# EasyEDA Pro project v10_b.eprj

# Schematic Schematic1
Board Name: Board1; Create Date: 2025-07-11; Page Name: P1; Project Name: v9_d_w_USB; Schematic Name: Schematic1; Update Date: 2025-12-03; Company: KC3LBR; Drawed: EasyEDA Pro; Page Size: A3; Part Number: JLCPCB-001; Reviewed: EasyEDA Pro; Version: 2023.09.11
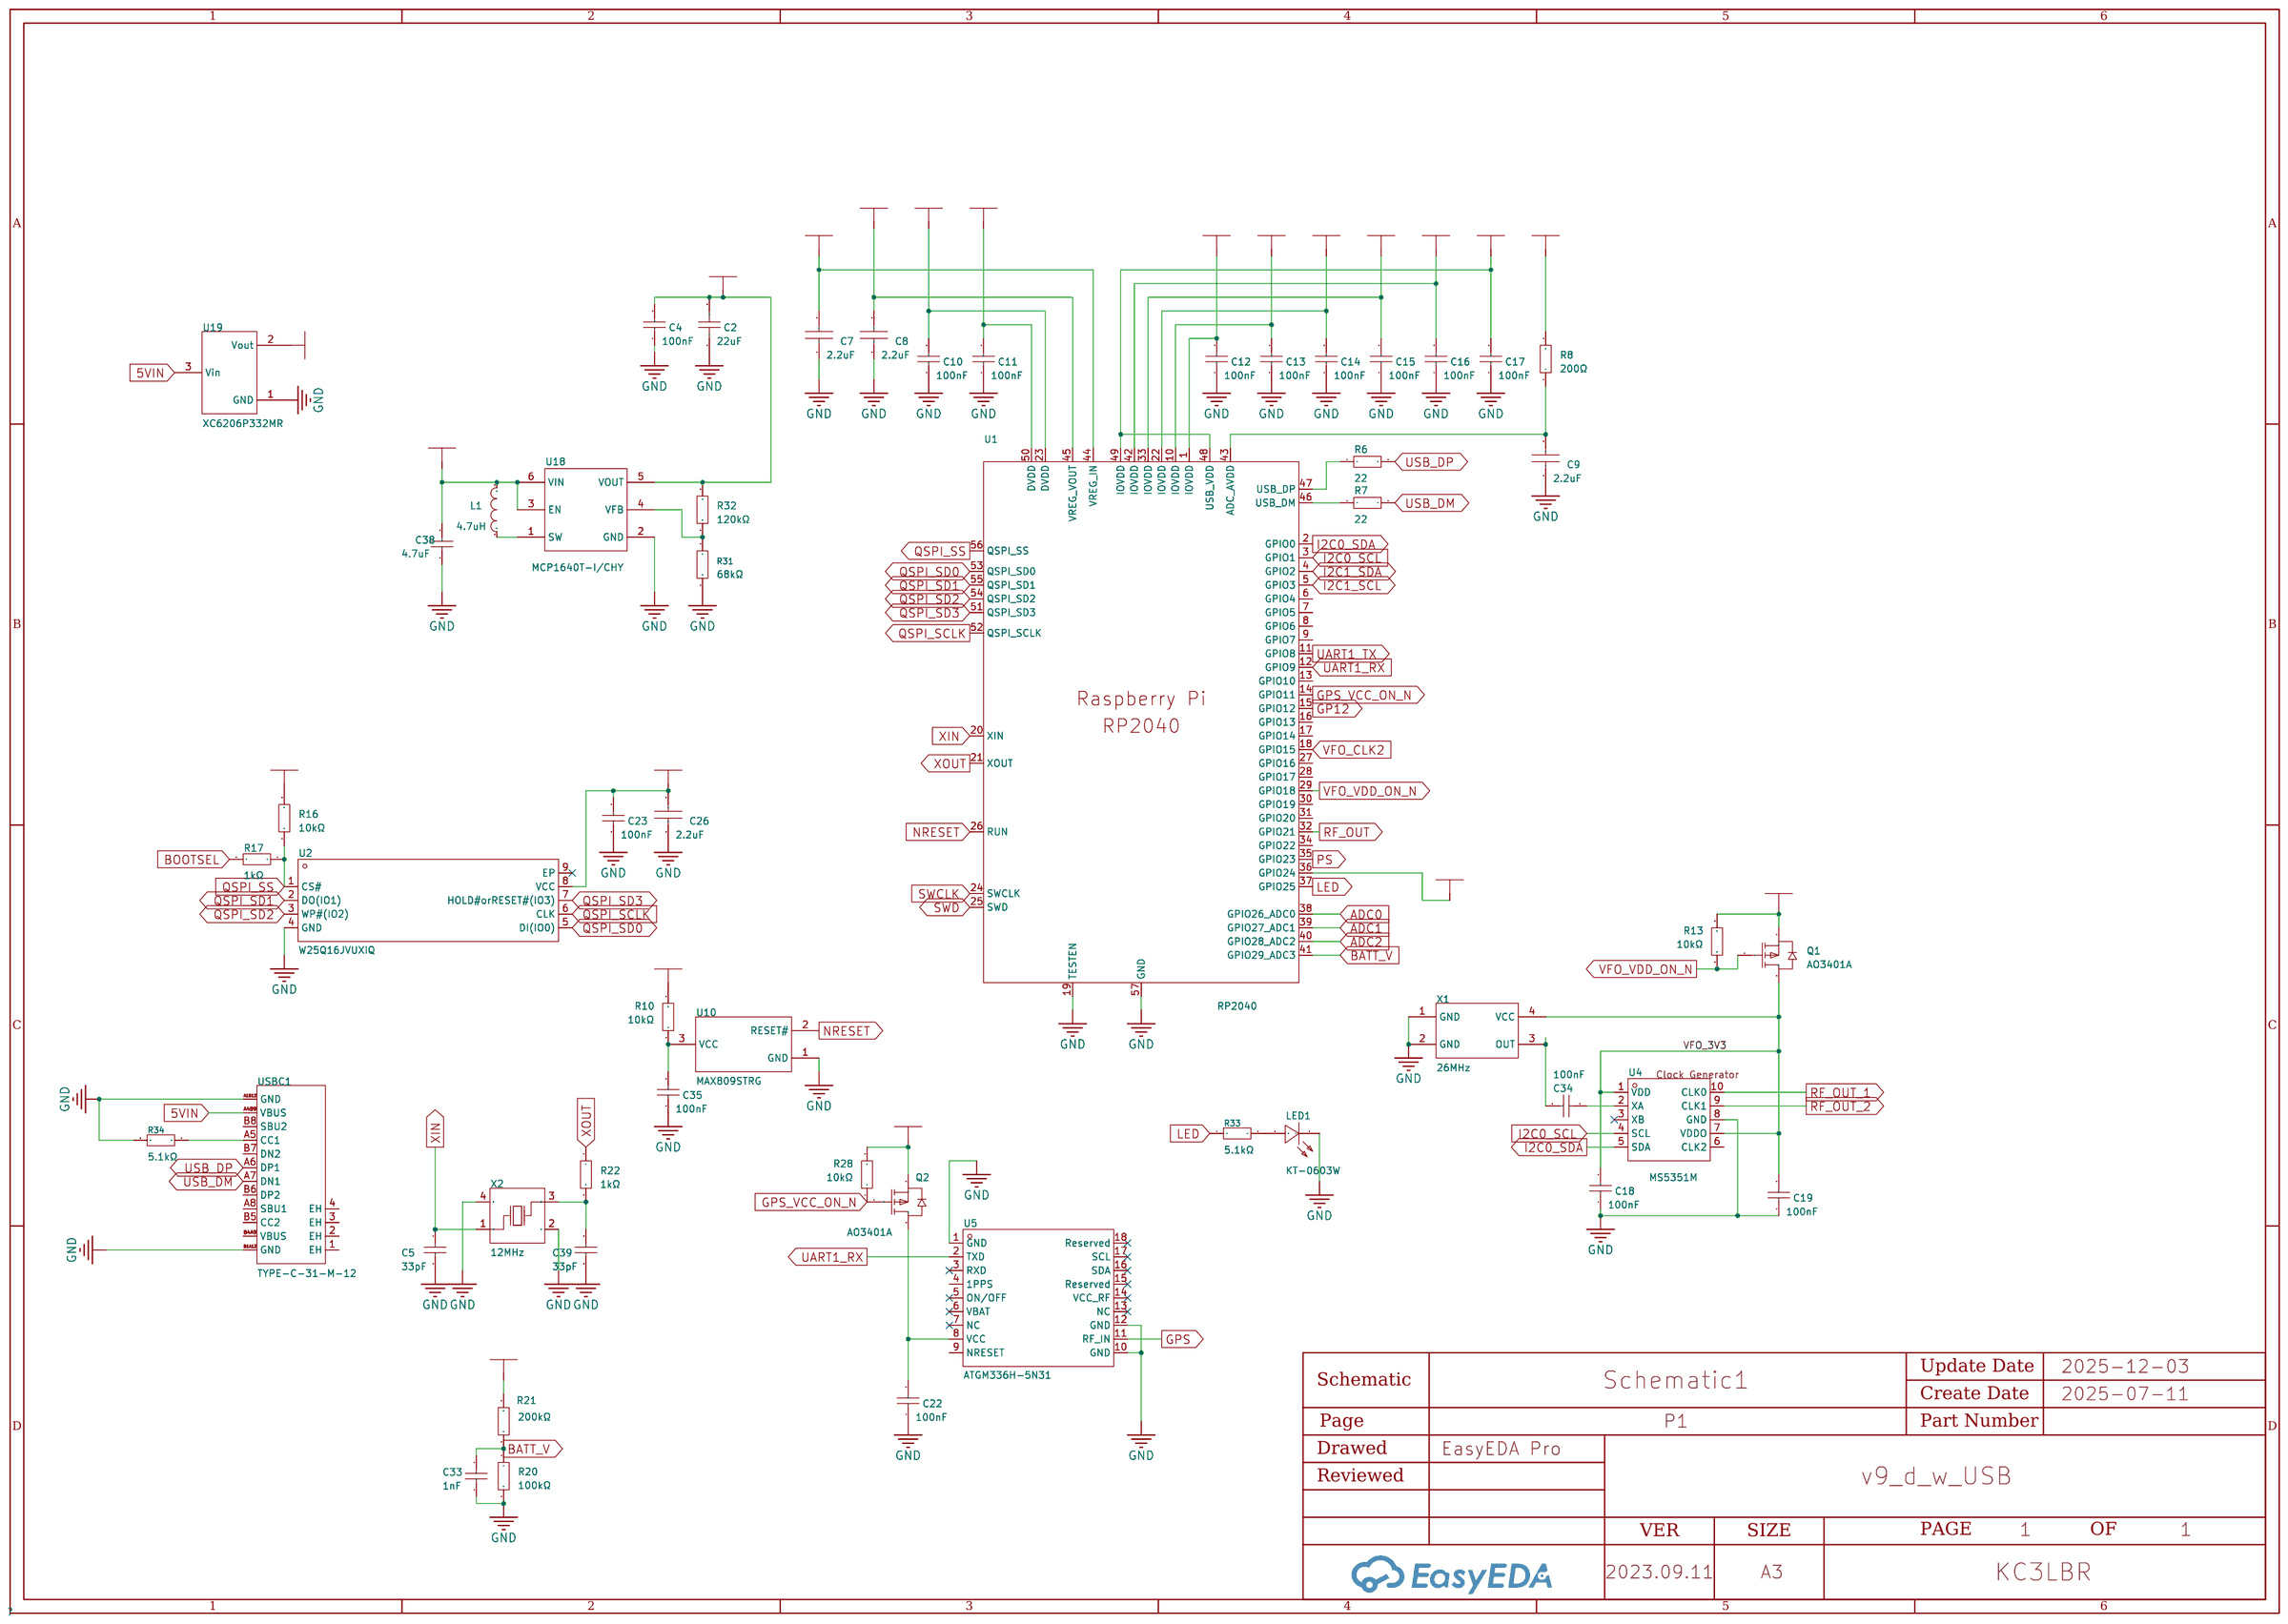
[diagram p0: schematic sheet]

## Parts
C2  22uF  [C0603]
C4  100nF  [C0402]
C5  33pF  [C0402]
C7  2.2uF  [C0402]
C8  2.2uF  [C0402]
C9  2.2uF  [C0402]
C10  100nF  [C0402]
C11  100nF  [C0402]
C12  100nF  [C0402]
C13  100nF  [C0402]
C14  100nF  [C0402]
C15  100nF  [C0402]
C16  100nF  [C0402]
C17  100nF  [C0402]
C18  100nF  [C0402]
C19  100nF  [C0402]
C22  100nF  [C0402]
C23  100nF  [C0402]
C26  2.2uF  [C0402]
C33  1nF  [C0402]
C34  100nF  [C0402]
C35  100nF  [C0402]
C38  4.7uF  [C0603]
C39  33pF  [C0402]
L1  4.7uH  [IND-SMD_L2.5-W1.8]
LED1  KT-0603W  [LED0603-R-RD_WHITE]
Q1  AO3401A  [SOT-23_L2.9-W1.3-P1.90-LS2.4-BR]
Q2  AO3401A  [SOT-23_L2.9-W1.3-P1.90-LS2.4-BR]
R6  22  [R0402]
R7  22  [R0402]
R8  200Ω  [R0402]
R10  10kΩ  [R0402]
R13  10kΩ  [R0402]
R16  10kΩ  [R0402]
R17  1kΩ  [R0402]
R20  100kΩ  [R0402]
R21  200kΩ  [R0402]
R22  1kΩ  [R0402]
R28  10kΩ  [R0402]
R31  68kΩ  [R0603]
R32  120kΩ  [R0603]
R33  5.1kΩ  [R0402]
R34  5.1kΩ  [R0402]
U1  RP2040  [LQFN-56_L7.0-W7.0-P0.4-EP]
U2  W25Q16JVUXIQ  [USON-8_L3.0-W2.0-P0.50-BL-EP]
U4  MS5351M  [MSOP-10_L3.0-W3.0-P0.50-LS5.0-BL]
U5  ATGM336H-5N31  [GPSM-SMD_ATGM336H-TR]
U10  MAX809STRG  [SOT-23-3_L2.9-W1.6-P1.90-LS2.8-BR]
U18  MCP1640T-I/CHY  [SOT-23-6_L2.9-W1.6-P0.95-LS2.8-BR]
U19  XC6206P332MR  [SOT-23-3_L2.9-W1.6-P1.90-LS2.8-BR]
USBC1  TYPE-C-31-M-12  [USB-C_SMD-TYPE-C-31-M-12_1]
X1  26MHz  [OSC-SMD_4P-L2.5-W2.0-BL]
X2  12MHz  [CRYSTAL-SMD_4P-L3.2-W2.5-BL]

## Library data of the parts
C2 = CL10A226MQ8NRNC: Capacitance: Tolerance:±20% Tolerance:±20% Voltage Rated: Temperature Coefficient:; LCSC Part Name: 22uF ±20% 6.3V; Supplier Part: C59461; Manufacturer: SAMSUNG(三星); Supplier Footprint: 0603; JLCPCB Part Class: Basic Part; Datasheet: https://atta.szlcsc.com/upload/public/pdf/source/20160218/1457707763339.pdf; Supplier: LCSC; Tolerance: ±20%
C4 C10-C17 C22 C23 = CL05B104KO5NNNC: Capacitance: Tolerance:±10% Tolerance:±10% Voltage Rated: Temperature Coefficient:; LCSC Part Name: 100nF ±10% 16V; Supplier Part: C1525; Manufacturer: SAMSUNG(三星); Supplier Footprint: 0402; JLCPCB Part Class: Basic Part; Datasheet: https://atta.szlcsc.com/upload/public/pdf/source/20160218/1457707763339.pdf; Supplier: LCSC; Tolerance: ±10%
C5 C39 = 0402CG330J500NT: Capacitance: Tolerance:±5% Tolerance:±5% Voltage Rated: Temperature Coefficient:; LCSC Part Name: 33pF ±5% 50V; Supplier Part: C1562; Manufacturer: FH(风华); Supplier Footprint: 0402; JLCPCB Part Class: Basic Part; Datasheet: https://atta.szlcsc.com/upload/public/pdf/source/20200305/C486355_26A10D38EF8C2A5C37091D0039909270.pdf; Supplier: LCSC; Tolerance: ±5%
C7-C9 C26 = CL05A225MQ5NSNC: Capacitance: Tolerance:±20% Tolerance:±20% Voltage Rated: Temperature Coefficient:; LCSC Part Name: 2.2uF ±20% 6.3V; Supplier Part: C12530; Manufacturer: SAMSUNG(三星); Supplier Footprint: 0402; JLCPCB Part Class: Basic Part; Datasheet: https://atta.szlcsc.com/upload/public/pdf/source/20160218/1457707763339.pdf; Supplier: LCSC; Tolerance: ±20%
C18 C19 C34 C35 = CL05B104KO5NNNC: Capacitance: Tolerance:±10% Tolerance:±10% Voltage Rated: Temperature Coefficient:; LCSC Part Name: 100nF ±10% 16V; Supplier Part: C1525; Manufacturer: SAMSUNG(三星); Supplier Footprint: 0402; JLCPCB Part Class: Basic Part; Datasheet: https://atta.szlcsc.com/upload/public/pdf/source/20160103/1457707674891.pdf; Supplier: LCSC; Tolerance: ±10%
C33 = 0402B102K500NT: Capacitance: Tolerance:±10% Tolerance:±10% Voltage Rated: Temperature Coefficient:; LCSC Part Name: 1nF ±10% 50V; Supplier Part: C1523; Manufacturer: FH(风华); Supplier Footprint: 0402; JLCPCB Part Class: Basic Part; Datasheet: https://atta.szlcsc.com/upload/public/pdf/source/20170923/C1523_1506149254821988331.pdf; Supplier: LCSC; Tolerance: ±10%
C38 = CL10A475KO8NNNC: Capacitance: Tolerance:±10% Tolerance:±10% Voltage Rated: Temperature Coefficient:; LCSC Part Name: 4.7uF ±10% 16V; Supplier Part: C19666; Manufacturer: SAMSUNG(三星); Supplier Footprint: 0603; JLCPCB Part Class: Basic Part; Datasheet: https://atta.szlcsc.com/upload/public/pdf/source/20160103/1457707703134.pdf; Supplier: LCSC; Tolerance: ±10%
L1 = CBC2518T4R7M: Type:- Inductance: Tolerance:±20% Tolerance:±20% Rated Current: Saturation Current (Isat):680mA DC Resistance (DCR): Ratings:-; LCSC Part Name: 4.7uH ±20% 680mA; Supplier Part: C268002; Manufacturer: TAIYO YUDEN(太诱); Supplier Footprint: SMD; JLCPCB Part Class: Extended Part; Datasheet: https://atta.szlcsc.com/upload/public/pdf/source/20180820/C268002_0E22732304EF0852B3951C6629BBBAB5.pdf; Supplier: LCSC; Tolerance: ±20%; Saturation Current (Isat): 680mA
LED1 = KT-0603W: LCSC Part Name: 0603 白灯 高亮; Supplier Part: C2290; Manufacturer: KENTO; Supplier Footprint: 0603; JLCPCB Part Class: Basic Part; Datasheet: https://item.szlcsc.com/datasheet/KT-0603W/2663.html; Supplier: LCSC; Illumination Color: White; Voltage - Forward(Vf): 2.6V~3.1V; Power(Watts): 100mW; Forward Current: 5mA; Luminous Intensity: 360mcd; Viewing Angle: 120°
Q1 Q2 = AO3401A_C15127: Type: Drain Source Voltage (Vdss): Continuous Drain Current (Id): Power Dissipation (Pd): Drain Source On Resistance (RDS(on)@Vgs,Id):44mΩ@10V,4.3A Gate Threshold Voltage (Vgs(th)@Id):1.3V@250uA; LCSC Part Name: P沟道 30V 4A; Supplier Part: C15127; Manufacturer: AOS; Supplier Footprint: SOT-23; JLCPCB Part Class: Basic Part; Datasheet: https://atta.szlcsc.com/upload/public/pdf/source/20160507/1462613609053.pdf; Supplier: LCSC; Drain Source On Resistance (RDS(on)@Vgs,Id): 44mΩ@10V,4.3A; Gate Threshold Voltage (Vgs(th)@Id): 1.3V@250uA
R6 R7 = 0402WGF220JTCE: LCSC Part Name: 22Ω(22R0) ±1% 编带; Supplier Part: C25092; Manufacturer: UNI-ROYAL(厚声); Supplier Footprint: 0402; JLCPCB Part Class: Basic Part; Datasheet: https://atta.szlcsc.com/upload/public/pdf/source/20170920/C25092_1505901206069982723.pdf; Supplier: LCSC
R8 = 0402WGF2000TCE: Type:Thick Film Resistors Resistance: Tolerance:±1% Tolerance:±1% Power(Watts): Temperature Coefficient:±100ppm/ Temperature Coefficient:±100ppm/ Overload Voltage (Max): Operating Temperature Range:-55~+155 Operating Temperature Range:-55~+155; LCSC Part Name: 200Ω ±1% 62.5mW; Supplier Part: C25087; Manufacturer: UNI-ROYAL(厚声); Supplier Footprint: 0402; JLCPCB Part Class: Basic Part; Datasheet: https://atta.szlcsc.com/upload/public/pdf/source/20200306/C422600_1E6D84923E4A46A82E41ADD87F860B5C.pdf; Supplier: LCSC; Type: Thick Film Resistors; Tolerance: ±1%; Temperature Coefficient: ±100ppm/; Operating Temperature Range: -55~+155
R10 R13 R16 R28 = 0402WGF1002TCE: Type:Thick Film Resistors Resistance: Tolerance:±1% Tolerance:±1% Power(Watts): Temperature Coefficient:±100ppm/ Temperature Coefficient:±100ppm/ Overload Voltage (Max): Operating Temperature Range:-55~+155 Operating Temperature Range:-55~+155; LCSC Part Name: 10kΩ ±1% 62.5mW; Supplier Part: C25744; Manufacturer: UNI-ROYAL(厚声); Supplier Footprint: 0402; JLCPCB Part Class: Basic Part; Datasheet: https://atta.szlcsc.com/upload/public/pdf/source/20200306/C422600_1E6D84923E4A46A82E41ADD87F860B5C.pdf; Supplier: LCSC; Type: Thick Film Resistors; Tolerance: ±1%; Temperature Coefficient: ±100ppm/; Operating Temperature Range: -55~+155
R17 R22 = 0402WGF1001TCE: Type:Thick Film Resistors Resistance: Tolerance:±1% Tolerance:±1% Power(Watts): Temperature Coefficient:±100ppm/ Temperature Coefficient:±100ppm/ Overload Voltage (Max): Operating Temperature Range:-55~+155 Operating Temperature Range:-55~+155; LCSC Part Name: 1kΩ ±1% 62.5mW; Supplier Part: C11702; Manufacturer: UNI-ROYAL(厚声); Supplier Footprint: 0402; JLCPCB Part Class: Basic Part; Datasheet: https://atta.szlcsc.com/upload/public/pdf/source/20200306/C422600_1E6D84923E4A46A82E41ADD87F860B5C.pdf; Supplier: LCSC; Type: Thick Film Resistors; Tolerance: ±1%; Temperature Coefficient: ±100ppm/; Operating Temperature Range: -55~+155
R20 = 0402WGF1003TCE: Type:Thick Film Resistors Resistance: Tolerance:±1% Tolerance:±1% Power(Watts): Temperature Coefficient:±100ppm/ Temperature Coefficient:±100ppm/ Overload Voltage (Max): Operating Temperature Range:-55~+155 Operating Temperature Range:-55~+155; LCSC Part Name: 100kΩ ±1% 62.5mW; Supplier Part: C25741; Manufacturer: UNI-ROYAL(厚声); Supplier Footprint: 0402; JLCPCB Part Class: Basic Part; Datasheet: https://atta.szlcsc.com/upload/public/pdf/source/20200306/C422600_1E6D84923E4A46A82E41ADD87F860B5C.pdf; Supplier: LCSC; Type: Thick Film Resistors; Tolerance: ±1%; Temperature Coefficient: ±100ppm/; Operating Temperature Range: -55~+155
R21 = 0402WGF2003TCE: Resistance: Tolerance: Power(Watts): Temperature Coefficient: Temperature Coefficient: Overload Voltage (Max): Operating Temperature Range: Operating Temperature Range:; LCSC Part Name: 200KΩ ±1%; Supplier Part: C25764; Manufacturer: UNI-ROYAL(厚声); Supplier Footprint: 0402; JLCPCB Part Class: Basic Part; Datasheet: https://atta.szlcsc.com/upload/public/pdf/source/20170920/C25764_1505901532268983339.pdf; Supplier: LCSC
R31 = 0603WAF6802T5E: LCSC Part Name: 68kΩ ±1% 100mW 厚膜电阻; Supplier Part: C23231; Manufacturer: UNI-ROYAL(厚声); Supplier Footprint: 0603; JLCPCB Part Class: Basic Part; Datasheet: https://item.szlcsc.com/datasheet/0603WAF6802T5E/23958.html; Supplier: LCSC; Type: Thick Film Resistor; Tolerance: ±1%; Power(Watts): 100mW; Voltage-Supply(Max): 75V; Temperature Coefficient: ±100ppm/℃; Operating Temperature: -55℃~+155℃
R32 = 0603WAF1203T5E: LCSC Part Name: 120kΩ ±1% 100mW 厚膜电阻; Supplier Part: C25808; Manufacturer: UNI-ROYAL(厚声); Supplier Footprint: 0603; JLCPCB Part Class: Basic Part; Datasheet: https://item.szlcsc.com/datasheet/0603WAF1203T5E/26551.html; Supplier: LCSC; Type: Thick Film Resistor; Tolerance: ±1%; Power(Watts): 100mW; Voltage-Supply(Max): 75V; Temperature Coefficient: ±100ppm/℃; Operating Temperature: -55℃~+155℃
R33 R34 = 0402WGF5101TCE: Type:Thick Film Resistors Resistance:5.1kΩ Tolerance:±1% Tolerance:±1% Power(Watts): Overload Voltage (Max): Temperature Coefficient:±100ppm/℃ Temperature Coefficient:±100ppm/℃ Operating Temperature Range:-55℃~+155℃ Operating Temperature Range:-55℃~+155℃; LCSC Part Name: 5.1kΩ ±1% 62.5mW 厚膜电阻; Supplier Part: C25905; Manufacturer: UNI-ROYAL(厚声); Supplier Footprint: 0402; JLCPCB Part Class: Basic Part; Datasheet: https://atta.szlcsc.com/upload/public/pdf/source/20200306/C422600_1E6D84923E4A46A82E41ADD87F860B5C.pdf; Supplier: LCSC; Type: Thick Film Resistors; Tolerance: ±1%; Temperature Coefficient: ±100ppm/℃; Operating Temperature Range: -55℃~+155℃
U1 = RP2040_C2040: CPU Core:- RAM Size:264KB GPIO Ports Number:30 Operating Voltage Range:- Operating Voltage Range:- CPU Maximum Speed:133MHz Program Memory Type:- Operating Temperature Range:- Operating Temperature Range:- ADC (Bit):12bit DAC (Bit):- PWM (Bit):- 8Bit Time; LCSC Part Name: RP2040（RP2B2）; Supplier Part: C2040; Manufacturer: Raspberry Pi(树莓派); Supplier Footprint: LQFN-56(7x7); JLCPCB Part Class: Extended Part; Datasheet: https://atta.szlcsc.com/upload/public/pdf/source/20210621/C2040_96F425825606B7957D87DD32E2512CA9.pdf; Supplier: LCSC; Maximum Frequency: 133MHz; RAM Size: 264KB; GPIO Ports Number: 30; ADC (Units/Channels/bits): 1@x4ch/12bit; U(S)ART Number: 2; I2C Number: 2; (Q)SPI Number: 2; USB (H/D/OTG): USB Host/Device; Peripherals / Functions / Protocol Stacks: DMA；PWM; CPU Maximum Speed: 133MHz; ADC (Bit): 12bit; UART/USART: 2; I2C: 2; SPI: 2; Universal Serial Bus: 有; Peripheral/Function: DMA；PWM; Direct Memory Access: 有
U2 = W25Q16JVUXIQ: Supplier Part: C2843335; Manufacturer: WINBOND(华邦); Supplier Footprint: USON-8-EP(2x3); JLCPCB Part Class: Extended Part; Datasheet: https://atta.szlcsc.com/upload/public/pdf/source/20210629/C2843335_FB4D78B5076715625DC0C83F790D3044.pdf; Supplier: LCSC
U4 = MS5351M: Clock Generator; Supplier Part: C1509083; Manufacturer: 杭州瑞盟; Supplier Footprint: MSOP-10; JLCPCB Part Class: Extended Part; Datasheet: https://atta.szlcsc.com/upload/public/pdf/source/20201224/C1509083_CDA7065E1A3FD8463EE02C96BD32A982.pdf; Supplier: LCSC; Interface: IIC; Output Frequency (Max): 200MHz; Supply Voltage: 2.25V~3.6V; Number of Outputs: 3; Output Low Voltage: 0.6V; Output High Voltage: 2.7V; Operating Temperatue: -55~+150
U5 = ATGM336H-5N31: LCSC Part Name: BDS/GNSS 全星座定位导航模块; Supplier Part: C90770; Manufacturer: 杭州中科微; Supplier Footprint: SMD,9.7x10.1mm; JLCPCB Part Class: Extended Part; Datasheet: https://atta.szlcsc.com/upload/public/pdf/source/20161226/1482720799860.pdf; Supplier: LCSC
U10 = MAX809STRG: Output Type:推挽 Reset Active Level:低电平有效 Number of Voltages Monitored:1 Threshold Voltage:2.93V Reset Timeout:140ms Operating Temperature:-40~+105@(TJ) Operating Temperature:-40~+105@(TJ) Type of the Power Management Chip:Simple reset/Power-on reset; LCSC Part Name: Voltage Supervisor, Very Low Supply Current, 3-Pin Microprocessor, Reset Monitor; Supplier Part: C9965; Manufacturer: onsemi(安森美); Supplier Footprint: SOT-23; JLCPCB Part Class: Extended Part; Datasheet: https://atta.szlcsc.com/upload/public/pdf/source/20170918/C9965_1505727085373976535.PDF; Supplier: LCSC; Output Type: 推挽; Reset Active Level: 低电平有效; Number of Voltages Monitored: 1; Threshold Voltage: 2.93V; Reset Timeout: 140ms; Operating Temperature: -40~+105@(TJ); Type of the Power Management Chip: Simple reset/Power-on reset
U18 = MCP1640T-I/CHY: Function:Boost type Synchronous Rectification:Yes Number of Outputs:1 Topology:Boost Input Voltage:0.8V~5.5V Input Voltage:0.8V~5.5V Output Voltage:2V~5.5V Output Voltage:2V~5.5V Output Current (Max):350mA Switching Frequency:500kHz; LCSC Part Name: 升压型 Vin=0.8V~5.5V Vout=2V~5.5V 350mA; Supplier Part: C44365; Manufacturer: MICROCHIP(美国微芯); Supplier Footprint: SOT-23-6; JLCPCB Part Class: Extended Part; Datasheet: https://atta.szlcsc.com/upload/public/pdf/source/20150319/1457707270677.pdf; Supplier: LCSC; Function: Boost type; Synchronous Rectification: Yes; Number of Outputs: 1; Topology: Boost; Input Voltage: 0.8V~5.5V; Output Voltage: 2V~5.5V; Output Current (Max): 350mA; Switching Frequency: 500kHz
U19 = XC6206P332MR_C5446: Output Type: Output Polarity:Positive Number of Outputs:1 Maximum Input Voltage:6V Output Voltage:3.3V~3.3V Output Voltage:3.3V~3.3V Dropout Voltage:680mV@(100mA) Output Current:200mA Power Supply Rejection Ratio (PSRR):-; LCSC Part Name: 正 Vin=6V Vout=3.3V 200mA; Supplier Part: C5446; Manufacturer: TOREX(特瑞仕); Supplier Footprint: SOT-23; JLCPCB Part Class: Basic Part; Datasheet: https://atta.szlcsc.com/upload/public/pdf/source/20130801/1457706628791.pdf; Supplier: LCSC; Output Polarity: Positive; Number of Outputs: 1; Maximum Input Voltage: 6V; Output Voltage: 3.3V~3.3V; Dropout Voltage: 680mV@(100mA); Output Current: 200mA
USBC1 = TYPE-C-31-M-12: Connector Type:Type-C Protocol Standard:- Gender:Female Mounting Type:- Number of Contacts:16P Number of Ports:1 Current Rating-Power:5A Operating Temperature:- Operating Temperature:-; LCSC Part Name: Type-C 母; Supplier Part: C165948; Manufacturer: 韩国韩荣; Supplier Footprint: SMD; JLCPCB Part Class: Extended Part; Datasheet: https://item.szlcsc.com/datasheet/TYPE-C-31-M-12/177331.html; Supplier: LCSC; Connector Type: Type-C; Gender: Female; Number of Contacts: 16P; Number of Ports: 1; Current Rating-Power: 5A
X1 = 1XXB26000MAA: Frequency: Frequency Stability:±1.5ppm Frequency Stability:±1.5ppm Supply Voltage:1.8V~2.8V Supply Voltage:1.8V~2.8V Supply Current (Max): Operating Temperature: Operating Temperature:; LCSC Part Name: 26MHz ±1.5ppm; Supplier Part: C132296; Manufacturer: KDS(大真空); Supplier Footprint: SMD2520-4P; JLCPCB Part Class: Extended Part; Datasheet: https://atta.szlcsc.com/upload/public/pdf/source/20171018/C132296_15083234896291043042.pdf; Supplier: LCSC; Frequency Stability: ±1.5ppm; Supply Voltage: 1.8V~2.8V
X2 = X322512MSB4SI: Crystal Type:Surface Mount Crystal Frequency: Normal temperature Frequency Tolerance:±10ppm Normal temperature Frequency Tolerance:±10ppm External load capacitor: Frequency Stability(Full temperature range):±20ppm Frequency Stability(Full temperature rang; LCSC Part Name: 12MHz ±10ppm 20pF; Supplier Part: C9002; Manufacturer: YXC(扬兴晶振); Supplier Footprint: SMD3225-4P; JLCPCB Part Class: Basic Part; Datasheet: https://atta.szlcsc.com/upload/public/pdf/source/20240329/19D5F850207469550BEB00D7DFEDBC7A.pdf; Supplier: LCSC; Crystal Type: Surface Mount Crystal; Normal temperature Frequency Tolerance: ±10ppm; Frequency Stability(Full temperature range): ±20ppm

## Nets
1V1: C8.2 C10.2 C11.2 U1.23(DVDD) U1.45(VREG_VOUT) U1.50(DVDD)
3V3: C2.2 C4.2 C7.2 C12.2 C13.2 C14.2 C15.2 C16.2 C17.2 C23.2 C26.2 Q1.2(S) Q2.2(S) R8.2 R10.2 R13.2 R16.2 R28.2 R32.2 U1.1(IOVDD) U1.10(IOVDD) U1.22(IOVDD) U1.33(IOVDD) U1.36(GPIO24) U1.42(IOVDD) U1.44(VREG_IN) U1.48(USB_VDD) U1.49(IOVDD) U2.8(VCC) U18.5(VOUT)
5VIN: U19.3(Vin) USBC1.A4B9(VBUS)
GND: C2.1 C4.1 C5.1 C7.1 C8.1 C9.1 C10.1 C11.1 C12.1 C13.1 C14.1 C15.1 C16.1 C17.1 C18.1 C19.1 C22.1 C23.1 C26.1 C33.1 C35.1 C38.1 C39.1 LED1.2(K) R20.2 R31.1 R34.1 U1.19(TESTEN) U1.57(GND) U2.4(GND) U4.8(GND) U5.1(GND) U5.10(GND) U5.12(GND) U10.1(GND) U18.2(GND) U19.1(GND) USBC1.A1B12(GND) USBC1.B1A12(GND) X1.1(GND) X1.2(GND) X2.2(GND) X2.4(GND)
VBUS: C38.2 L1.2 R21.2 U18.3(EN) U18.6(VIN) U19.2(Vout)
ADC0: U1.38(GPIO26_ADC0)
ADC1: U1.39(GPIO27_ADC1)
ADC2: U1.40(GPIO28_ADC2)
ADC_AVDD: C9.2 R8.1 U1.43(ADC_AVDD)
BATT_V: C33.2 R20.1 R21.1 U1.41(GPIO29_ADC3)
BOOTSEL: R17.2
GP12: U1.15(GPIO12)
GPS: U5.11(RF_IN)
GPS_3V3: C22.2 Q2.3(D) U5.8(VCC)
GPS_VCC_ON_N: Q2.1(G) R28.1 U1.14(GPIO11)
I2C0_SCL: U1.3(GPIO1) U4.4(SCL)
I2C0_SDA: U1.2(GPIO0) U4.5(SDA)
I2C1_SCL: U1.5(GPIO3)
I2C1_SDA: U1.4(GPIO2)
LED: R33.1 U1.37(GPIO25)
NRESET: U1.26(RUN) U10.2(RESET#)
PS: U1.35(GPIO23)
QSPI_SCLK: U1.52(QSPI_SCLK) U2.6(CLK)
QSPI_SD0: U1.53(QSPI_SD0) U2.5(DI(IO0))
QSPI_SD1: U1.55(QSPI_SD1) U2.2(DO(IO1))
QSPI_SD2: U1.54(QSPI_SD2) U2.3(WP#(IO2))
QSPI_SD3: U1.51(QSPI_SD3) U2.7(HOLD#orRESET#(IO3))
QSPI_SS: R16.1 R17.1 U1.56(QSPI_SS) U2.1(CS#)
RF_OUT: U1.32(GPIO21)
RF_OUT_1: U4.10(CLK0)
RF_OUT_2: U4.9(CLK1)
SWCLK: U1.24(SWCLK)
SWD: U1.25(SWD)
UART1_RX: U1.12(GPIO9) U5.2(TXD)
UART1_TX: U1.11(GPIO8)
USB_DM: R7.2 USBC1.A7(DN1)
USB_DP: R6.2 USBC1.A6(DP1)
VFO_3V3: C18.2 C19.2 Q1.3(D) U4.1(VDD) U4.7(VDDO) X1.4(VCC)
VFO_CLK2: U1.18(GPIO15)
VFO_VDD_ON_N: Q1.1(G) R13.1 U1.29(GPIO18)
XIN: C5.2 U1.20(XIN) X2.1(OSC1)
XOUT: R22.1 U1.21(XOUT)
$1N22007: R7.1 U1.46(USB_DM)
$1N22362: R6.1 U1.47(USB_DP)
$1N70752: C39.2 R22.2 X2.3(OSC2)
$1N115739: C35.2 R10.1 U10.3(VCC)
$1N152319: L1.1 U18.1(SW)
$1N152323: R31.2 R32.1 U18.4(VFB)
$1N173176: C34.1 U4.2(XA)
$1N173179: C34.2 X1.3(OUT)
$1N182710: LED1.1(A) R33.2
$1N186291: R34.2 USBC1.A5(CC1)

Not connected (* = marked no-connect by the designer): U1 6(GPIO4) 7(GPIO5) 8(GPIO6) 9(GPIO7) 13(GPIO10) 16(GPIO13) 17(GPIO14) 27(GPIO16) 28(GPIO17) 30(GPIO19) 31(GPIO20) 34(GPIO22); U2 9(EP)*; U4 3(XB)* 6(CLK2); U5 3(RXD)* 4(1PPS) 5(ON/OFF)* 6(VBAT)* 7(NC)* 9(NRESET) 13(NC)* 14(VCC_RF)* 15(Reserved)* 16(SDA)* 17(SCL)* 18(Reserved)*; USBC1 1(EH) 2(EH) 3(EH) 4(EH) A8(SBU1) B4A9(VBUS) B5(CC2) B6(DP2) B7(DN2) B8(SBU2)

# Board PCB1
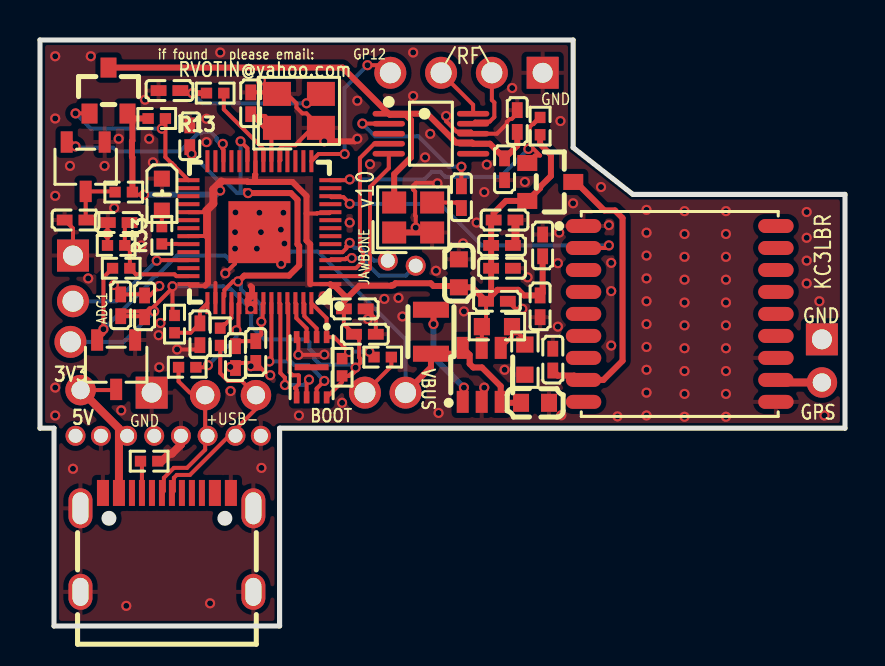
[diagram p1: board, top side]
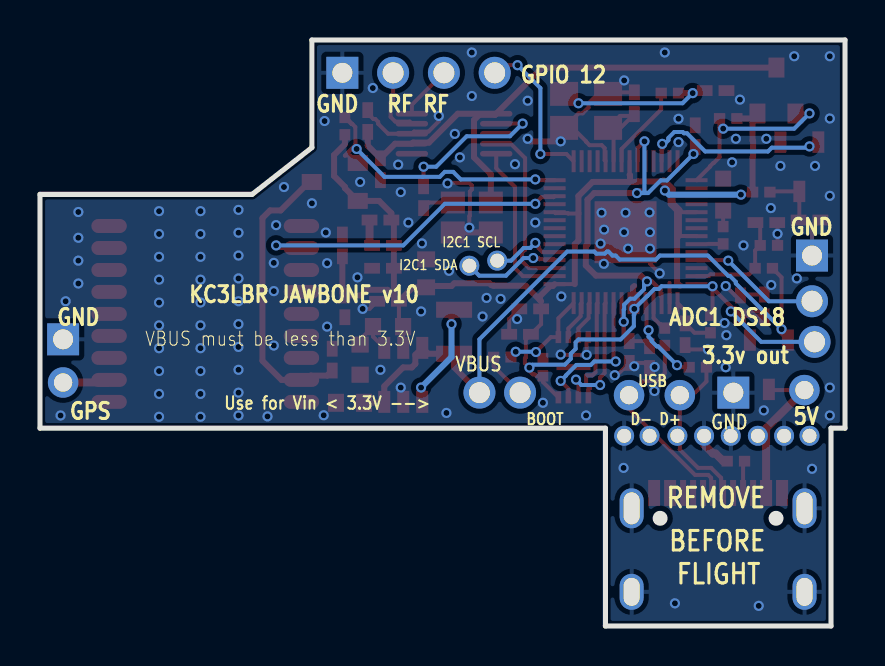
[diagram p2: board, bottom side, seen from below]

Outline 40.27 x 29.32 mm; copper layers: Top Layer, Bottom Layer. Coordinates in mm from the lower left corner of the outline.
Outline path: 0,29.32 26.67,29.32 26.67,23.94 29.66,21.6 40.27,21.6 40.27,9.9 11.99,9.9 11.99,0 0.7,0 0.7,9.9 0,9.9 0,29.32
Stack: Top Layer 0.035mm / Dielectric1 1.51mm FR4 er 4.5 / Bottom Layer 0.035mm

## Design rules (mm)
template: User Custom Config
spacing safeClearance (default): track to track 0.152, other pairs 0.12 to 0.3
track width trackWidth (default): min 0.127, default 0.154, max 2.54
track width ThickTrack: min 0.3, default 0.4, max 2.54
differential pair differentialPair (default): width min 0.127, default 0.254, max 2.54; gap min 0.152, default 0.152
via viaSize (default): diameter min 0.5, default 0.508, max 10; hole min 0.3, default 0.3, max 5.999

## Placement (name value [footprint] x y rotation side)
C2  22uF  [C0603]  20.96 17.65 270 top
C4  100nF  [C0402]  16.26 14.6 180 top
C5  33pF  [C0402]  10.54 26.16 270 top
C7  2.2uF  [C0402]  5.23 16 270 top
C8  2.2uF  [C0402]  10.8 13.71 90 top
C9  2.2uF  [C0402]  8 14.6 90 top
C10  100nF  [C0402]  7.49 24.5 270 top
C11  100nF  [C0402]  9.78 13.45 90 top
C12  100nF  [C0402]  23.11 17.9 180 top
C13  100nF  [C0402]  25.15 19.04 270 top
C14  100nF  [C0402]  22.86 16.25 180 top
C15  100nF  [C0402]  4.04 16.05 270 top
C16  100nF  [C0402]  15.75 15.87 180 top
C17  100nF  [C0402]  23.11 19.04 180 top
C18  100nF  [C0402]  23.24 22.85 90 top
C19  100nF  [C0402]  23.88 25.27 270 top
C22  100nF  [C0402]  25.65 13.33 270 top
C23  100nF  [C0402]  25.02 16 90 top
C26  2.2uF  [C0402]  23.24 20.31 180 top
C33  1nF  [C0402]  3.94 20.19 0 top
C34  100nF  [C0402]  21.08 21.46 270 top
C35  100nF  [C0402]  1.78 20.31 0 top
C38  4.7uF  [C0603]  24.77 11.17 180 top
C39  33pF  [C0402]  6.48 26.79 0 top
L1  4.7uH  [IND-SMD_L2.5-W1.8]  19.56 14.73 270 top
LED1  KT-0603W  [LED0603-R-RD_WHITE]  6.1 21.58 270 top
NOREF  -  [Pad_e420]  4.36 9.52 0 top
NOREF#2  -  [Pad_e833]  1.65 18.53 0 top
NOREF#3  -  [Pad_e4139]  16.26 11.68 0 top
NOREF#4  -  [Pad_e1583]  18.29 11.68 0 top
NOREF#5  -  [Pad_e796]  17.53 27.68 0 top
NOREF#6  -  [Pad_e813]  25.15 27.68 0 top
NOREF#7  -  [Pad_e620]  22.61 27.68 0 top
NOREF#8  -  [Pad_e5]  18.8 18.03 0 top
NOREF#9  -  [Pad_e10]  2.03 11.8 0 top
NOREF#10  -  [Pad_e409]  3.05 9.52 0 top
NOREF#11  -  [Pad_e617]  20.07 27.68 0 top
NOREF#12  -  [Pad_e429]  11.05 9.52 0 top
NOREF#13  -  [Pad_e19]  5.59 11.68 0 top
NOREF#14  -  [Pad_e422]  7.05 9.52 0 top
NOREF#15  -  [Pad_e2]  39.12 12.19 0 top
NOREF#16  -  [Pad_e4]  17.4 18.28 0 top
NOREF#17  -  [Pad_e1763]  10.8 11.55 0 top
NOREF#18  -  [Pad_e37]  39.12 14.34 0 top
NOREF#19  -  [Pad_e425]  8.39 9.52 0 top
NOREF#20  -  [Pad_e41]  1.65 16.25 0 top
NOREF#21  -  [Pad_e1784]  8.26 11.55 0 top
NOREF#22  -  [Pad_e1305]  1.52 14.22 0 top
NOREF#23  -  [Pad_e408]  1.78 9.52 0 top
NOREF#24  -  [Pad_e421]  5.72 9.52 0 top
NOREF#25  -  [Pad_e426]  9.78 9.52 0 top
Q1  AO3401A  [SOT-23_L2.9-W1.3-P1.90-LS2.4-BR]  3.43 26.79 270 top
Q2  AO3401A  [SOT-23_L2.9-W1.3-P1.90-LS2.4-BR]  25.53 22.22 180 top
R6  22  [R0402]  7.37 12.95 180 top
R7  22  [R0402]  9.02 14.47 270 top
R8  200Ω  [R0402]  6.73 15.11 90 top
R10  10kΩ  [R0402]  4.19 21.71 0 top
R13  10kΩ  [R0402]  5.84 25.39 180 top
R16  10kΩ  [R0402]  15.11 12.95 270 top
R17  1kΩ  [R0402]  17.15 13.45 0 top
R20  100kΩ  [R0402]  3.81 19.04 180 top
R21  200kΩ  [R0402]  4.06 17.9 180 top
R22  1kΩ  [R0402]  8.76 26.66 180 top
R28  10kΩ  [R0402]  25.02 25.01 270 top
R31  68kΩ  [R0603]  24.26 13.33 90 top
R32  120kΩ  [R0603]  22.86 14.98 180 top
R33  5.1kΩ  [R0402]  6.1 19.55 90 top
R34  5.1kΩ  [R0402]  5.46 8.25 180 top
U1  RP2040  [LQFN-56_L7.0-W7.0-P0.4-EP]  10.98 19.71 180 top
U2  W25Q16JVUXIQ  [USON-8_L3.0-W2.0-P0.50-BL-EP]  13.59 12.95 180 top
U4  MS5351M  [MSOP-10_L3.0-W3.0-P0.50-LS5.0-BL]  19.56 24.63 270 top
U5  ATGM336H-5N31  [GPSM-SMD_ATGM336H-TR]  32 15.61 90 top
U10  MAX809STRG  [SOT-23-3_L2.9-W1.6-P1.90-LS2.8-BR]  2.29 22.98 90 top
U18  MCP1640T-I/CHY  [SOT-23-6_L2.9-W1.6-P0.95-LS2.8-BR]  22.1 12.57 270 top
U19  XC6206P332MR  [SOT-23-3_L2.9-W1.6-P1.90-LS2.8-BR]  3.81 13.07 90 top
USBC1  TYPE-C-31-M-12  [USB-C_SMD-TYPE-C-31-M-12_1]  6.35 4.18 0 top
X1  26MHz  [OSC-SMD_4P-L2.5-W2.0-BL]  18.67 20.44 0 top
X2  12MHz  [CRYSTAL-SMD_4P-L3.2-W2.5-BL]  12.95 25.77 0 top

## Footprints (pads in the part's own frame, mm; a bottom-side part is the same pattern mirrored in y, then rotated)
C0402
  rect 0.79x0.54 smd: 1(-0.545,0) 2(0.545,0)
C0603
  rect 0.8x0.9 smd: 1(-0.7,0) 2(0.7,0)
CRYSTAL-SMD_4P-L3.2-W2.5-BL
  rect 1.4x1.2 smd: 1(-1.1,-0.85) 2(1.1,-0.85) 3(1.1,0.85) 4(-1.1,0.85)
GPSM-SMD_ATGM336H-TR
  oval 0.7x1.773 smd: 1(4.4,4.811) 2(3.3,4.811) 3(2.2,4.811) 4(1.1,4.811) 5(0,4.811) 6(-1.1,4.811) 7(-2.2,4.811) 8(-3.3,4.811) 9(-4.4,4.811) 10(-4.4,-4.811) 11(-3.3,-4.811) 12(-2.2,-4.811) 13(-1.1,-4.811) 14(0,-4.811) 15(1.1,-4.811) 16(2.2,-4.811) 17(3.3,-4.811) 18(4.4,-4.811)
IND-SMD_L2.5-W1.8
  rect 0.8x1.8 smd: 1(-1.1,0) 2(1.1,0)
LED0603-R-RD_WHITE
  rect 0.8x0.8 smd: 1(0.8,0) 2(-0.8,0)
LQFN-56_L7.0-W7.0-P0.4-EP
  rect 1.1x0.2 smd: 1(-3.55,2.6) 2(-3.55,2.2) 3(-3.55,1.8) 4(-3.55,1.4) 5(-3.55,1) 6(-3.55,0.6) 7(-3.55,0.2) 8(-3.55,-0.2) 9(-3.55,-0.6) 10(-3.55,-1) 11(-3.55,-1.4) 12(-3.55,-1.8) 13(-3.55,-2.2) 14(-3.55,-2.6) 29(3.55,-2.6) 30(3.55,-2.2) 31(3.55,-1.8) 32(3.55,-1.4) 33(3.55,-1) 34(3.55,-0.6) 35(3.55,-0.2) 36(3.55,0.2) 37(3.55,0.6) 38(3.55,1) 39(3.55,1.4) 40(3.55,1.8) 41(3.55,2.2) 42(3.55,2.6)
  rect 0.2x1.1 smd: 15(-2.6,-3.55) 16(-2.2,-3.55) 17(-1.8,-3.55) 18(-1.4,-3.55) 19(-1,-3.55) 20(-0.6,-3.55) 21(-0.2,-3.55) 22(0.2,-3.55) 23(0.6,-3.55) 24(1,-3.55) 25(1.4,-3.55) 26(1.8,-3.55) 27(2.2,-3.55) 28(2.6,-3.55) 43(2.6,3.55) 44(2.2,3.55) 45(1.8,3.55) 46(1.4,3.55) 47(1,3.55) 48(0.6,3.55) 49(0.2,3.55) 50(-0.2,3.55) 51(-0.6,3.55) 52(-1,3.55) 53(-1.4,3.55) 54(-1.8,3.55) 55(-2.2,3.55) 56(-2.6,3.55)
  rect 3.1x3.1 smd: 57(0,0)
MSOP-10_L3.0-W3.0-P0.50-LS5.0-BL
  oval 0.28x1.62 smd: 1(-1,-2.11) 2(-0.5,-2.11) 3(0,-2.11) 4(0.5,-2.11) 5(1,-2.11) 6(1,2.11) 7(0.5,2.11) 8(0,2.11) 9(-0.5,2.11) 10(-1,2.11)
OSC-SMD_4P-L2.5-W2.0-BL
  rect 1.2x1.1 smd: 1(-0.95,-0.75) 2(0.95,-0.75) 3(0.95,0.75) 4(-0.95,0.75)
Pad_e2
  round 1.524 hole 0.914: 17(0,0)
Pad_e4
  round 1 hole 0.7: 17(0,0)
Pad_e5
  round 1 hole 0.7: 17(0,0)
Pad_e10
  round 1.524 hole 0.914: 17(0,0)
Pad_e19
  rect 1.6x1.6 hole 1: 7(0,0)
Pad_e37
  rect 1.6x1.6 hole 1: 7(0,0)
Pad_e41
  round 1.6 hole 1.05: 17(0,0)
Pad_e408
  round 1 hole 0.7: 17(0,0)
Pad_e409
  round 1 hole 0.7: 17(0,0)
Pad_e420
  round 1 hole 0.7: 17(0,0)
Pad_e421
  round 1 hole 0.7: 17(0,0)
Pad_e422
  round 1 hole 0.7: 17(0,0)
Pad_e425
  round 1 hole 0.7: 17(0,0)
Pad_e426
  round 1 hole 0.7: 17(0,0)
Pad_e429
  round 1 hole 0.7: 17(0,0)
Pad_e617
  round 1.6 hole 1.05: 17(0,0)
Pad_e620
  round 1.6 hole 1.05: 17(0,0)
Pad_e796
  round 1.6 hole 1.05: 17(0,0)
Pad_e813
  rect 1.6x1.6 hole 1: 7(0,0)
Pad_e833
  rect 1.6x1.6 hole 1: 7(0,0)
Pad_e1305
  round 1.6 hole 1.05: 15(0,0)
Pad_e1583
  round 1.6 hole 1.05: 18(0,0)
Pad_e1763
  round 1.524 hole 0.914: 17(0,0)
Pad_e1784
  round 1.524 hole 0.914: 17(0,0)
Pad_e4139
  round 1.6 hole 1.05: 18(0,0)
R0402
  rect 0.566x0.54 smd: 1(-0.433,0) 2(0.433,0)
R0603
  rect 0.806x0.864 smd: 1(-0.753,0) 2(0.753,0)
SOT-23-3_L2.9-W1.6-P1.90-LS2.8-BR
  rect 1.07x0.6 smd: 1(1.235,-0.95) 2(1.235,0.95) 3(-1.235,0)
SOT-23-6_L2.9-W1.6-P0.95-LS2.8-BR
  rect 1.1x0.6 smd: 1(1.35,-0.95) 2(1.35,0) 3(1.35,0.95) 4(-1.35,0.95) 5(-1.35,0) 6(-1.35,-0.95)
SOT-23_L2.9-W1.3-P1.90-LS2.4-BR
  rect 1x0.8 smd: 1(1.15,-0.95) 2(1.15,0.95) 3(-1.15,0)
USB-C_SMD-TYPE-C-31-M-12_1
  oval 1.2x2 hole 0.8x1.6: 1(4.325,1.706) 4(-4.325,1.706)
  oval 1.2x1.8 hole 0.8x1.4: 2(4.325,-2.474) 3(-4.325,-2.474)
  custom 0.6x1.3 smd: A1B12(-3.2,2.474) A4B9(-2.4,2.474) B1A12(3.2,2.474) B4A9(2.401,2.474)
  rect 0.3x1.3 smd: A5(-1.25,2.474) A6(-0.25,2.474) A7(0.25,2.474) A8(1.25,2.474) B5(1.75,2.474) B6(0.75,2.474) B7(-0.75,2.474) B8(-1.75,2.474)
USON-8_L3.0-W2.0-P0.50-BL-EP
  rect 0.28x0.6 smd: 1(-0.75,-1.508) 2(-0.25,-1.508) 3(0.25,-1.508) 4(0.75,-1.508) 5(0.75,1.508) 6(0.25,1.508) 7(-0.25,1.508) 8(-0.75,1.508)
  rect 1.7x0.3 smd: 9(0,0)

## Nets
1V1: C8.2 C10.2 C11.2 U1.23 U1.45 U1.50
3V3: C2.2 C4.2 C7.2 C12.2 C13.2 C14.2 C15.2 C16.2 C17.2 C23.2 C26.2 NOREF#22.15 Q1.2 Q2.2 R8.2 R10.2 R13.2 R16.2 R28.2 R32.2 U1.1 U1.10 U1.22 U1.33 U1.36 U1.42 U1.44 U1.48 U1.49 U2.8 U18.5
5VIN: NOREF.17 NOREF#9.17 U19.3 USBC1.A4B9
GND: C2.1 C4.1 C5.1 C7.1 C8.1 C9.1 C10.1 C11.1 C12.1 C13.1 C14.1 C15.1 C16.1 C17.1 C18.1 C19.1 C22.1 C23.1 C26.1 C33.1 C35.1 C38.1 C39.1 LED1.2 NOREF#2.7 NOREF#6.7 NOREF#10.17 NOREF#12.17 NOREF#13.7 NOREF#14.17 NOREF#18.7 NOREF#24.17 R20.2 R31.1 R34.1 U1.19 U1.57 U2.4 U4.8 U5.1 U5.10 U5.12 U10.1 U18.2 U19.1 USBC1.1 USBC1.2 USBC1.3 USBC1.4 USBC1.A1B12 USBC1.B1A12 X1.1 X1.2 X2.2 X2.4
VBUS: C38.2 L1.2 NOREF#4.18 R21.2 U18.3 U18.6 U19.2
ADC0: U1.38
ADC1: NOREF#20.17 U1.39
ADC2: U1.40
ADC_AVDD: C9.2 R8.1 U1.43
BATT_V: C33.2 R20.1 R21.1 U1.41
BOOTSEL: NOREF#3.18 R17.2
GP12: NOREF#5.17 U1.15
GPS: NOREF#15.17 U5.11
GPS_3V3: C22.2 Q2.3 U5.8
GPS_VCC_ON_N: Q2.1 R28.1 U1.14
I2C0_SCL: U1.3 U4.4
I2C0_SDA: U1.2 U4.5
I2C1_SCL: NOREF#16.17 U1.5
I2C1_SDA: NOREF#8.17 U1.4
LED: R33.1 U1.37
NRESET: U1.26 U10.2
PS: U1.35
QSPI_SCLK: U1.52 U2.6
QSPI_SD0: U1.53 U2.5
QSPI_SD1: U1.55 U2.2
QSPI_SD2: U1.54 U2.3
QSPI_SD3: U1.51 U2.7
QSPI_SS: R16.1 R17.1 U1.56 U2.1
RF_OUT: U1.32
RF_OUT_1: NOREF#11.17 U4.10
RF_OUT_2: NOREF#7.17 U4.9
SWCLK: U1.24
SWD: U1.25
UART1_RX: U1.12 U5.2
UART1_TX: U1.11
USB_DM: NOREF#17.17 NOREF#25.17 R7.2 USBC1.A7
USB_DP: NOREF#19.17 NOREF#21.17 R6.2 USBC1.A6
VFO_3V3: C18.2 C19.2 Q1.3 U4.1 U4.7 X1.4
VFO_CLK2: U1.18
VFO_VDD_ON_N: Q1.1 R13.1 U1.29
XIN: C5.2 U1.20 X2.1
XOUT: R22.1 U1.21
$1N22007: R7.1 U1.46
$1N22362: R6.1 U1.47
$1N70752: C39.2 R22.2 X2.3
$1N115739: C35.2 R10.1 U10.3
$1N152319: L1.1 U18.1
$1N152323: R31.2 R32.1 U18.4
$1N173176: C34.1 U4.2
$1N173179: C34.2 X1.3
$1N182710: LED1.1 R33.2
$1N186291: R34.2 USBC1.A5

Pads without a net: NOREF#23 17; U1 6 7 8 9 13 16 17 27 28 30 31 34; U2 9; U4 3 6; U5 3 4 5 6 7 9 13 14 15 16 17 18; USBC1 A8 B4A9 B5 B6 B7 B8

## Via types
v1: diameter 0.508, hole 0.3, Top Layer to Bottom Layer, 167 vias

## Routing (per net, layer and track width the routed paths; a pad name or vN(x,y) marks a point on that pad's centre or on a via; arc(x,y) is an arc through that point)
1V1: length 23.9
  Top Layer w0.2: C11.2 10.03,14.25 C8.2 10.8,14.31 11.07,14.59 v1(11.07,15.23) 11.14,15.29 11.14,16.1 11.19,16.15 U1.50 ; U1.23 10.38,23.91 v1(10.03,24.25) ; 9.23,16.5 9.23,16.81 9.66,17.24 v1(9.91,17.24) ; v1(10.41,21.66) 10.26,21.82
  Top Layer w0.3: v1(10.41,21.66) 12.55,21.66 12.88,21.33 12.88,19.1 12.97,19.01 12.97,18.04 12.46,17.53 10.22,17.53 9.93,17.24 v1(9.91,17.24)
  Bottom Layer w0.2: v1(7.58,23.62) 8.91,22.29 9.22,22.29 9.86,21.66 10.12,21.66 ; v1(10.41,21.66) 10.12,21.66 ; 10.12,21.66 10.03,21.75 v1(10.03,24.25) ; v1(11.07,15.23) 11.07,15.82 11.05,15.85 11.05,16.08 10.75,16.37 10.53,16.37 10.05,16.86 10.05,17.1 v1(9.91,17.24)
3V3: length 89.2
  Top Layer w0.2: 6.63,16.92 6.63,15.64 R8.2 ; 6.63,16.92 5.61,15.89 5.49,15.89 5.33,15.74 ; 6.63,16.92 v1(6.63,17) ; R10.2 4.75,21.58 v1(5.21,21.58) ; U1.36 7.43,19.51 8.31,19.51 ; 10.38,16.16 U1.49 ; 5.33,15.74 4.28,15.74 C15.2 5.18,15.5 C7.2 5.23,15.64 5.33,15.74 ; 5.33,15.74 v1(5.72,15.74) ; U1.44 8.78,17.17 ; 13.33,20.64 13.85,20.64 13.87,20.66 14.48,20.66 U1.10 ; 8.26,17.02 7.51,17.02 U1.42 ; 13.52,17.11 U1.1 ; U18.5 22.11,13.92 R32.2 22.31,15.19 C14.2 ; 10.78,22.58 U1.22 ; U2.8 15.11,12.21 R16.2 15.45,12.51 15.53,12.59 15.61,12.59 15.76,12.74 15.76,12.9 v1(15.79,12.93) 16.02,13.16 16.02,13.39 15.97,13.43 15.97,14.34 C4.2 15.2,15.11 C16.2 15.2,16.25 ; U1.33 8.24,20.71
  Top Layer w0.3: 10.54,17.01 10.61,16.94 10.61,16.52 10.38,16.29 10.38,16.16 ; R28.2 25.02,24.11 25.56,23.57 25.56,22.52 25.02,21.98 25.02,21.91 Q2.2 23.31,21.27 22.7,20.66 C26.2 22.57,20.19 C17.2 C12.2 22.57,16.5 22.89,16.82 23.93,16.82 24.21,16.54 C23.2 25.15,16.67 C13.2 ; 8.26,17.02 8.4,17.17 8.4,20.77 ; 9.07,22.25 10.37,22.25 10.4,22.22 10.76,22.22 ; 10.76,22.22 10.76,22.56 10.78,22.58 ; 10.76,22.22 12.63,22.22 13.33,21.51 13.33,19.28 13.52,19.1 13.52,17.11 ; 14.53,17.1 14.62,17.01 14.75,17.01 15.27,16.49 15.27,16.31 ; 5.38,25.39 5.41,25.37 ; 5.38,25.39 5.41,25.39 R13.2 5.41,25.37 ; 5.38,25.39 4.62,25.39 ; 5.41,25.37 5.46,25.32 ; 4.62,25.39 4.38,25.64 ; 4.62,25.39 4.62,24.29 4.6,24.26 4.6,23.47 4.62,23.45 R10.2 ; 8.31,19.51 8.31,20.77 ; C14.2 21.62,16.95 C2.2 20.89,17.01 19.69,17.01 19.55,17.15 17.78,17.15 17.68,17.05 17.6,17.05 17.58,17.03 15.98,17.03 15.27,16.31 ; 15.27,16.31 15.2,16.25
  Top Layer w0.4: 8.31,20.77 8.67,21.13 8.67,21.85 9.07,22.25
  Bottom Layer w0.2: NOREF#22.15 4.19,14.22 v1(5.72,15.74) ; 10.57,15.56 10.56,15.56 10.54,15.58 v1(10.54,15.87) 9.91,16.5 9.89,16.5 9.53,16.86 9.32,16.86 9.18,17 v1(6.63,17) ; 10.57,15.56 10.57,15 11.23,14.34 13.34,14.34 13.48,14.2 13.48,13.87 13.72,13.63 13.72,13.37 14.01,13.08 15.64,13.08 v1(15.79,12.93)
  Bottom Layer w0.3: v1(5.21,21.58) 8.81,21.58 v1(9.01,21.79)
5VIN: length 7.8
  Top Layer w0.2: NOREF#9.17 3.81,11.8 U19.3
  Top Layer w0.4: NOREF#9.17 3.95,9.89 USBC1.A4B9
GND: length 37
  Top Layer w0.2: v1(9.76,18.88) 9.76,18.13 v1(9.27,17.65) ; v1(5.97,17.01) 5.5,16.54 C7.1 5.18,16.59 C15.1 ; NOREF#2.7 1.65,19.89 1.23,20.31 ; C33.1 3.38,20.17 v1(3.38,19.62) R20.2 ; U1.19 12.03,23.3 12.03,23.91 12.17,24.06 12.78,24.06 12.95,24.23 12.95,24.25 13.63,24.92 X2.2 13.33,25.65 13.13,25.65 12.83,25.95 12.83,26.15 12.35,26.62 X2.4 11.78,26.7 C5.1 ; v1(12.93,13.57) 12.93,14.37 U2.4 ; C4.1 16.8,15.36 C16.1 ; 13.05,13.57 14.21,13.57 v1(14.22,13.58) ; v1(19.88,22.15) 19.85,22.18 18.81,22.18 18.67,22.04 18.67,21.84 18.77,21.74 18.77,20.54 18.8,20.51 v1(18.8,19.93) ; v1(11.52,12.55) 11.41,12.55 C8.1 10.03,13.16 C11.1 ; C19.1 23.88,25.65 23.6,25.37 23.5,25.37 23.35,25.22 23.35,25.12 22.86,24.63 U4.8 21.56,24.74 20.84,24.74 20.32,25.25 v1(20.32,25.52) ; C9.1 7.78,13.84 v1(6.86,13.84) ; C14.1 23.79,15.87 v1(24.13,15.87)
  Top Layer w0.3: v1(15.88,24.38) 15.75,24.25 v1(14.22,24.25) ; X1.1 X1.2
  Top Layer w0.4: C26.1 23.79,19.17 23.66,19.04 ; NOREF#14.17 7.05,9.08 6.6,8.63 6.48,8.63 6.1,8.25 R34.1
  vias: v1(0.76,28.51) v1(0.76,25.39) v1(0.76,21.52) v1(0.76,11.93) v1(0.76,10.53) v1(1.5,23.02) v1(1.65,7.87) v1(2.41,17.39) v1(2.54,28.51) v1(3.23,23.02) v1(3.71,20.91) v1(3.69,17.06) v1(3.94,24.38) v1(4.06,10.79) v1(4.32,1.01) v1(5.08,19.04) v1(5.26,26.34) v1(5.46,24.38) v1(5.65,23.2) v1(5.94,14.55) v1(6.03,15.16) v1(5.97,12.95) v1(8.33,25.38) v1(8.33,24.21) v1(8.51,1.14) v1(9.02,28.7) v1(9.52,12.96) v1(9.53,11.76) v1(9.78,20.69) v1(9.76,19.71) v1(10.55,13) v1(10.85,18.88) v1(10.98,20.68) v1(11.05,27.3) v1(11.05,19.71) v1(11.08,7.91) v1(12.05,19.83) v1(12.06,18.12) v1(12.18,20.68) v1(12.23,19.14) v1(12.95,10.53) v1(14.19,16.49) v1(15.11,11.17) v1(15.49,20.19) v1(15.88,26.28) v1(16.4,15.36) v1(16.51,23.11) v1(17.23,16.37) v1(17.93,16.42) v1(18.13,15.49) v1(18.67,28.7) v1(18.67,26.52) v1(19.27,23.45) v1(19.52,24.62) v1(19.81,17.77) v1(19.94,10.66) v1(21.17,19.14) v1(21.21,15.74) v1(21.84,20.19) v1(22.23,21.71) v1(22.23,11.93) v1(22.35,23.09) v1(23.24,12.82) v1(23.62,26.92) v1(24.26,22.22) v1(24.39,17.45) v1(25.91,18.15) v1(25.91,14.98) v1(26.04,25.27) v1(25.97,19.69) v1(26.08,10.54) v1(26.67,21.15) v1(28.07,21.96) v1(28.46,20.06) v1(28.58,18.17) v1(28.58,16.76) v1(28.58,14.03) v1(28.89,10.49) v1(30.34,20.82) v1(30.34,19.68) v1(30.34,18.53) v1(30.34,17.39) v1(30.34,16.25) v1(30.34,15.11) v1(30.34,13.96) v1(30.34,12.82) v1(30.34,11.68) v1(30.34,10.53) v1(32.24,20.76) v1(32.24,19.61) v1(32.24,18.47) v1(32.24,17.33) v1(32.24,16.19) v1(32.24,15.04) v1(32.24,13.9) v1(32.24,12.76) v1(32.24,11.61) v1(32.24,10.47) v1(34.32,20.76) v1(34.32,19.61) v1(34.32,18.47) v1(34.32,17.33) v1(34.32,16.19) v1(34.32,15.04) v1(34.32,13.9) v1(34.32,12.76) v1(34.32,11.61) v1(34.32,10.47) v1(38.35,20.71) v1(38.35,19.42) v1(38.35,18.28) v1(38.35,17.14) v1(38.99,16.25) v1(39.24,10.53)
VBUS: length 34.4
  Top Layer w0.2: U19.2 3.18,14.62 v1(3.18,14.85) 3.18,17.44 R21.2
  Top Layer w0.3: NOREF#4.18 19.56,12.95 L1.2 20.86,13.62 U18.6 21.5,13.57 21.5,13.11 21.67,12.94 22.11,12.94 23.05,12 U18.3 23.09,11.17 24.06,11.17
  Bottom Layer w0.2: v1(3.18,14.85) 5.46,17.14 5.46,17.22 5.76,17.52 5.84,17.52 6.86,18.53 9.26,18.53 9.46,18.34 11.27,18.34 11.47,18.53 11.63,18.53 11.83,18.73 11.91,18.73 12.02,18.63 12.44,18.63 12.54,18.73 13.9,18.73 18.29,14.34 NOREF#4.18
ADC1: length 6.6
  Top Layer w0.2: U1.39 5.87,18.31 v1(5.84,18.28)
  Bottom Layer w0.2: NOREF#20.17 3.81,16.25 v1(5.84,18.28)
ADC_AVDD: length 2.6
  Top Layer w0.2: U1.43 8,15.78 C9.2 7.53,14.67 R8.1
BATT_V: length 5.7
  Top Layer w0.2: U1.41 6.82,17.51 6.73,17.59 4.8,17.59 R21.1 4.5,18.79 4.24,19.04 4.24,20.17 4.47,20.17 C33.2
BOOTSEL: length 2.3
  Top Layer w0.2: R17.2 17.58,13 NOREF#3.18
GP12: length 8
  Top Layer w0.2: v1(16.38,28.06) 17.15,28.06 NOREF#5.17 ; U1.15 13.94,23.62 v1(15.24,23.62)
  Bottom Layer w0.2: v1(15.24,23.62) 15.24,26.92 v1(16.38,28.06)
GPS: length 2.4
  Top Layer w0.4: NOREF#15.17 36.94,12.19 U5.11
GPS_3V3: length 14.4
  Top Layer w0.3: C22.2 25.91,12.53 26.72,12.53 26.94,12.31 U5.8 28.19,12.31 29.14,13.27 29.14,20.41 28.76,20.79 28.23,20.79 26.8,22.22 Q2.3
GPS_VCC_ON_N: length 14.7
  Top Layer w0.2: 24.5,24.06 24.5,23.93 v1(24.43,23.87) ; 24.5,24.06 25.02,23.54 24.75,23.54 Q2.1 ; 24.5,24.06 24.5,24.97 24.64,25.11 ; 24.64,25.11 24.98,25.45 R28.1 24.69,25.11 24.64,25.11 ; v1(15.49,22.34) 15.45,22.31 U1.14
  Bottom Layer w0.2: v1(24.43,23.87) 23.04,22.47 21.13,22.47 21.13,22.47 20.27,22.47 20.02,22.72 19.6,22.72 19.22,22.34 v1(15.49,22.34)
I2C0_SCL: length 8.7
  Top Layer w0.2: U4.4 16.72,24.13 16,23.41 16,18.83 16.16,18.68 16.16,18.26 15.81,17.91 U1.3
I2C0_SDA: length 8.3
  Top Layer w0.2: U4.5 17.45,22.9 16.51,21.97 16.51,17.9 16.12,17.51 U1.2
I2C1_SCL: length 3.5
  Top Layer w0.2: U1.5 15.13,18.71 15.33,18.9 15.33,19.01 v1(15.49,19.17)
  Bottom Layer w0.2: v1(15.49,19.17) 15.75,18.92 16.07,18.92 16.71,18.28 NOREF#16.17
I2C1_SDA: length 4.9
  Top Layer w0.2: U1.4 14.58,18.35 15.28,18.35 15.34,18.41 v1(15.6,18.41)
  Bottom Layer w0.2: v1(15.6,18.41) 16.08,18.41 16.96,17.53 18.3,17.53 NOREF#8.17
LED: length 0.8
  Top Layer w0.2: R33.1 6.86,19.12
NRESET: length 9.5
  Top Layer w0.2: U10.2 1.56,24.22 v1(1.78,24) ; 9.13,24.01 9.13,23.88 9.18,23.84 U1.26
  Bottom Layer w0.2: v1(9.14,24.12) 9.02,24.12 8.84,24.3 8.84,24.42 8.54,24.72 8.12,24.72 8.06,24.65 7.9,24.65 6.99,23.74 3.86,23.74 3.67,23.93 1.84,23.93 v1(1.78,24)
QSPI_SCLK: length 6.5
  Top Layer w0.2: v1(12.25,12.06) 12.25,12.43 12.03,12.66 12.03,16.11 U1.52 ; U2.6 13.34,12.21 v1(13.46,12.33)
  Bottom Layer w0.2: v1(12.25,12.06) 13.19,12.06 v1(13.46,12.33)
QSPI_SD0: length 5.2
  Top Layer w0.2: U1.53 12.42,16.11 12.42,13.36 12.49,13.29 12.49,12.69 12.63,12.55 12.93,12.55 12.95,12.52 12.95,12.1 12.76,11.91 12.76,11.9 12.84,11.82 U2.5
QSPI_SD1: length 2
  Top Layer w0.2: U1.55 13.23,16.11 13.23,15.5 13.84,14.89 U2.2
QSPI_SD2: length 1.9
  Top Layer w0.2: U2.3 13.34,14.89 12.83,15.4 12.83,16.11 U1.54
QSPI_SD3: length 7.1
  Top Layer w0.2: U2.7 13.84,11.88 v1(14.22,12.26) ; v1(11.47,13.23) 11.58,13.34 U1.51
  Bottom Layer w0.2: v1(11.47,13.23) 12.54,13.23 12.72,13.06 13.44,13.06 13.96,12.54 13.96,12.52 v1(14.22,12.26)
QSPI_SS: length 5
  Top Layer w0.2: U1.56 14.34,15.39 U2.1 14.72,14.45 v1(15.46,13.71) 15.13,13.38 15.11,13.38
  Bottom Layer w0.2: v1(15.46,13.71) 15.48,13.72 v1(16.47,13.72)
RF_OUT_1: length 2.7
  Top Layer w0.2: U4.10 21.67,26.08 NOREF#11.17
RF_OUT_2: length 3.5
  Top Layer w0.2: NOREF#7.17 22.61,26.32 22.73,26.19 22.73,25.47 22.5,25.24 21.78,25.24 U4.9
UART1_RX: length 16.3
  Top Layer w0.2: U5.2 28.33,18.91 v1(28.46,19.04) ; v1(15.49,21.12) 15.49,21.15 15.18,21.46 14.58,21.46 U1.12
  Bottom Layer w0.2: v1(28.46,19.04) 22.1,19.04 20.02,21.12 v1(15.49,21.12)
USB_DM: length 10.6
  Top Layer w0.2: R7.2 9.02,12.65 9.4,12.26 10.09,12.26 NOREF#17.17 10.8,10.86 7.5,7.56 6.85,7.56 6.7,7.41 6.7,6.76 USBC1.A7
USB_DP: length 7.7
  Top Layer w0.2: NOREF#21.17 8.26,8.82 7.35,7.91 6.7,7.91 6.2,7.41 6.2,6.76 USBC1.A6 ; 7.49,11.68 6.93,12.24 R6.2
VFO_3V3: length 29
  Top Layer w0.3: C19.2 23.88,24.03 C18.2 22.51,24.13 U4.7 21.61,24.19 20.81,24.19 19.37,25.63 U4.1 ; X1.4 17.72,22.61 18.56,23.45 18.56,25.31 18.3,25.57 17.51,25.57 U4.1 ; U4.1 15.14,27.94 3.43,27.94
VFO_VDD_ON_N: length 9.1
  Top Layer w0.2: v1(1.78,25.65) 2.47,25.65 Q1.1 ; R13.1 6.28,24.94 ; 6.28,24.94 6.15,24.94 v1(6.1,24.89) ; 6.28,24.94 6.28,23.46 6.57,23.16 6.6,23.16 6.74,23.01 6.74,22.99 U1.29
  Bottom Layer w0.2: v1(1.78,25.65) 2.54,24.89 v1(6.1,24.89)
XIN: length 4.3
  Top Layer w0.2: 10.63,25.52 C5.2 ; 10.63,25.52 11.58,24.57 U1.20 ; 10.63,25.52 11.26,25.52 X2.1
XOUT: length 4.2
  Top Layer w0.2: R22.1 9.2,25.85 11.18,23.87 ; 11.18,23.87 U1.21
$1N22007: length 1.5
  Top Layer w0.2: 9.02,14.9 9.21,15.09 9.26,15.09 9.58,15.41 U1.46
$1N22362: length 4.4
  Top Layer w0.2: v1(8.41,13.05) 8.3,12.95 R6.1 ; U1.47 9.93,16.11 9.93,14.9 v1(9.83,14.8)
  Bottom Layer w0.2: v1(8.41,13.05) 9.35,13.99 9.42,13.99 9.68,14.25 9.68,14.32 9.83,14.48 v1(9.83,14.8)
$1N70752: length 7.5
  Top Layer w0.2: X2.3 13.59,26.16 v1(13.34,26.16)
  Top Layer w0.3: v1(7.62,26.66) R22.2
  Bottom Layer w0.2: v1(7.62,26.66) 8.13,26.16 v1(13.34,26.16)
$1N115739: length 2.9
  Top Layer w0.2: R10.1 3.72,21.75 U10.3 2.29,20.35 C35.2
$1N152319: length 5.3
  Top Layer w0.3: U18.1 21.15,11.87 v1(21.21,11.93) ; v1(19.69,15.11) 19.69,15.7 L1.1
  Bottom Layer w0.3: v1(21.21,11.93) 19.69,13.45 v1(19.69,15.11)
$1N152323: length 2.5
  Top Layer w0.2: U18.4 23.61,14.48 R32.1 24.26,14.34 R31.2
$1N173176: length 8.1
  Top Layer w0.2: U4.2 17.44,25.14 v1(16.13,25.14) ; C34.1 v1(21.08,22.98)
  Bottom Layer w0.2: v1(16.13,25.14) 16.76,24.5 18.93,24.5 20.45,22.98 v1(21.08,22.98)
$1N173179: length 1.6
  Top Layer w0.2: C34.2 20.8,21.19 X1.3
$1N182710: length 0.8
  Top Layer w0.2: R33.2 LED1.1
$1N186291: length 1.6
  Top Layer w0.2: R34.2 5.1,8.18 USBC1.A5

## Copper pours and planes (outline as drawn; the poured copper is in the pictures)
3V3 on Top Layer: 8.25,22.5 8.82,22.5 8.82,16.98 8.25,16.98
3V3 on Top Layer: 10.34,17.23 17.4,17.23 17.4,17.01 10.34,17.01
3V3 on Top Layer: 13.27,22.5 13.64,22.5 13.64,16.94 13.27,16.94
3V3 on Top Layer: 8.82,22.5 13.64,22.5 13.64,22.12 8.82,22.12
GND on Top Layer: -16.38,31.23 45.21,31.23 45.21,-0.52 -16.38,-0.52
GND on Bottom Layer: -20.7,37.97 43.18,37.97 43.18,-9.02 -20.7,-9.02

Small or netless copper shapes (teardrops, artwork), in the pictures only: 2 on Top Layer

## Text on the board
Bottom Silkscreen Layer: I2C1 SCL | I2C1 SDA | USB | D- D+ | BOOT | Use for Vin < 3.3V --> | VBUS must be less than 3.3V | GND | VBUS | 5V | 3.3v out | ADC1 DS18 | GPIO 12 | RF RF | KC3LBR JAWBONE v10 | GPS | FLIGHT | BEFORE | REMOVE
Top Silkscreen Layer: JAWBONE | if found | please email: | GP12 | ADC1 | GND | +USB- | VBUS | BOOT | RVOTIN@yahoo.com | GPS | 3V3 | 5V | KC3LBR | /RF\ | v10
